# Altium schematic sheet 06-SIM800C.SchDoc: *MODUL SIM800
size A3; SheetNumber: 7; SheetTotal: 7
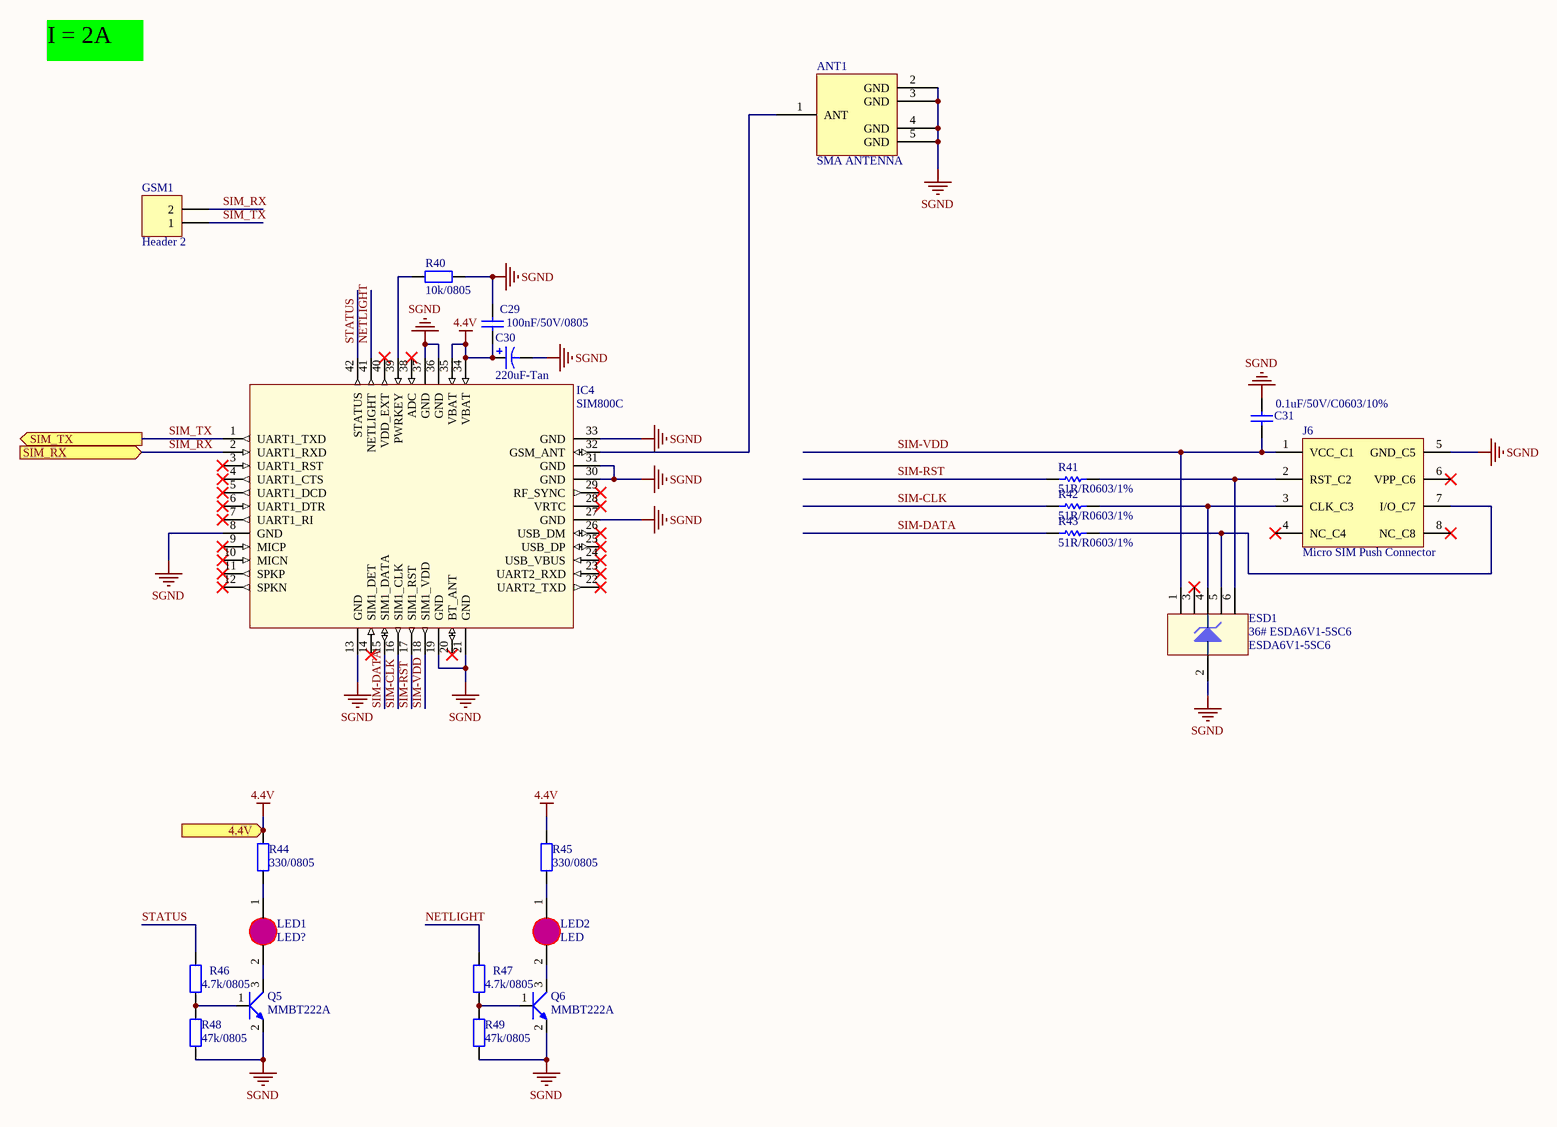
[diagram p0: 06-SIM800C.SchDoc]

## Parts
ANT1  SMA ANTENNA  [ANT-SMA-ST-F]
C29  100nF/50V/0805  [Cap Ceramic 0805 SMD]
C30  220uF-Tan  [CAP TANT CASE E SMD]
C31  0.1uF/50V/C0603/10%  [Cap Ceramic 0603 SMD]
ESD1  36# ESDA6V1-5SC6  Supplier Part Number 1: ESDA6V1-5SC6  [36# ESDA6V1-5SC6]
GSM1  Header 2  [Header_2]
IC4  SIM800C  [SIM800C]
J6  Micro SIM Push Connector  [9# SIM holder]
LED1  LED?  [Led 0805R]
LED2  LED  [Led 0805R]
Q5  MMBT222A  [MMBT2222A]
Q6  MMBT222A  [MMBT2222A]
R40  10k/0805  [RESC2012(0805)]
R41  51R/R0603/1%  [Res 0603 SMD]
R42  51R/R0603/1%  [Res 0603 SMD]
R43  51R/R0603/1%  [Res 0603 SMD]
R44  value 330/0805  [RESC2012(0805)]  (hidden comment: R0805)
R45  value 330/0805  [RESC2012(0805)]  (hidden comment: R0805)
R46  value 4.7k/0805  [RESC2012(0805)]  (hidden comment: R0805)
R47  value 4.7k/0805  [RESC2012(0805)]  (hidden comment: R0805)
R48  value 47k/0805  [RESC2012(0805)]  (hidden comment: R0805)
R49  value 47k/0805  [RESC2012(0805)]  (hidden comment: R0805)

## Ports
4.4V (in), SIM_RX (in), SIM_TX (out)

## Nets
4.4V: C29.1 C30.1 IC4.34(VBAT) IC4.35(VBAT) R44.1 R45.1 ; port 4.4V
SGND: ANT1.2(GND) ANT1.3(GND) ANT1.4(GND) ANT1.5(GND) C29.2 C30.2 C31.2 ESD1.2(GND) IC4.8(GND) IC4.13(GND) IC4.19(GND) IC4.21(GND) IC4.27(GND) IC4.30(GND) IC4.31(GND) IC4.33(GND) IC4.36(GND) IC4.37(GND) J6.5(GND_C5) Q5.2 Q6.2 R40.2 R48.2 R49.2
NETLIGHT: IC4.41(NETLIGHT) R47.1
SIM-CLK: IC4.16(SIM1_CLK) R42.1
SIM-DATA: IC4.15(SIM1_DATA) R43.1
SIM-RST: IC4.17(SIM1_RST) R41.1
SIM-VDD: C31.1 ESD1.1(IO1) IC4.18(SIM1_VDD) J6.1(VCC_C1)
SIM_RX: GSM1.2 IC4.2(UART1_RXD) ; port SIM_RX
SIM_TX: GSM1.1 IC4.1(UART1_TXD) ; port SIM_TX
STATUS: IC4.42(STATUS) R46.1
NetANT1_1: ANT1.1(ANT) IC4.32(GSM_ANT)
NetESD1_4: ESD1.4(IO3) J6.3(CLK_C3) R42.2
NetESD1_5: ESD1.5(IO4) J6.7(I/O_C7) R43.2
NetESD1_6: ESD1.6(IO5) J6.2(RST_C2) R41.2
NetIC4_39: IC4.39(PWRKEY) R40.1
NetLED1_1: LED1.1(A) R44.2
NetLED1_2: LED1.2(K) Q5.3
NetLED2_1: LED2.1(A) R45.2
NetLED2_2: LED2.2(K) Q6.3
NetQ5_1: Q5.1 R46.2 R48.1
NetQ6_1: Q6.1 R47.2 R49.1

Not connected (* = marked no-connect by the designer): ESD1 3(IO2)*; IC4 3(UART1_RST)* 4(UART1_CTS)* 5(UART1_DCD)* 6(UART1_DTR)* 7(UART1_RI)* 9(MICP)* 10(MICN)* 11(SPKP)* 12(SPKN)* 14(SIM1_DET)* 20(BT_ANT)* 22(UART2_TXD)* 23(UART2_RXD)* 24(USB_VBUS)* 25(USB_DP)* 26(USB_DM)* 28(VRTC)* 29(RF_SYNC)* 38(ADC)* 40(VDD_EXT)*; J6 4(NC_C4)* 6(VPP_C6)* 8(NC_C8)*

## Notes on the sheet
- I = 2A
- Title
- Size:
- Date:
- A3
- Number:
- Time:
- Revision:
- Sheet
- of
- File:

## Library data of the parts
C29 = CapSMD: Value: 33p; Published: 8-Jun-2000; LatestRevisionDate: 17-Jul-2002; LatestRevisionNote: Re-released for DXP Platform.; PackageReference: RAD-0.3; Publisher: Altium Limited
C30 = CAP1210-Tan
C31 = 0.1uF/50V/C0603/10%: CAP CER 0.1UF 50V 10% X7R 0603; Manufacturer: Murata Electronics North America; Manufacturer Part Number: GRM188R71H104KA93D; Capacitance: 0.1µF; RoHS: RoHS Compliant; Category: Capacitors; Packaging: Tape & Reel (TR); Tolerance: ±10%; Voltage - Rated: 50V; Temperature Coefficient: X7R; Mounting Type: Surface Mount, MLCC; Operating Temperature: -55°C ~ 125°C; Applications: General Purpose; Ratings: -; Package / Case: 0603 (1608 Metric); Size / Dimension: 0.063" L x 0.031" W (1.60mm x 0.80mm); Height - Seated (Max): -; Thickness (Max): 0.035" (0.90mm); Lead Spacing: -; Features: -; Lead Style: -; ComponentLink1URL: http://www.murata.com/~/media/webrenewal/support/library/catalog/products/capacitor/mlcc/c02e.ashx; ComponentLink1Description: http://www.murata.com/~/media/webrenewal/support/library/catalog/products/capacitor/mlcc/c02e.ashx; Supplier 1: Digi-Key; Supplier Part Number 1: 490-1519-1-ND
ESD1 = 36# ESDA6V1-5SC6: TRANSIL™ ARRAY FOR ESD PROTECTION; Supplier 1: Future Electronics
GSM1 = Header 2: Header, 2-Pin; LatestRevisionDate: 17-Jul-2002; LatestRevisionNote: Re-released for DXP Platform.; Publisher: Altium Limited
IC4 = SIM800C: SIM800C V1.00
J6 = 9#SIM Card Holder KF-016: https://www.alibaba.com/product-detail/Micro-SIM-Push-Connector-SIM-Card_60749325624.html?spm=a2700.7724838.2017115.23.25ee5ac4b0uZwo
LED1 LED2 = LED0805: LED SMD 0805
R40 R44-R49 = R0805: Resistor SMD 0805; Published: 8-Jun-2000; LatestRevisionDate: 17-Jul-2002; LatestRevisionNote: Re-released for DXP Platform.; PackageReference: AXIAL-0.4; Publisher: Altium Limited
R41-R43 = 22R/R0603/1%: RES SMD 22 OHM 1% 1/10W 0603; Manufacturer: Yageo; Manufacturer Part Number: RC0603FR-0722RL; Resistance (Ohms): 22; Power (Watts): 0.1W, 1/10W; Temperature Coefficient: ±100ppm/°C; RoHS: RoHS Compliant; Category: Resistors; Packaging: Cut Tape (CT); Tolerance: ±1%; Composition: Thick Film; Features: Moisture Resistant; Operating Temperature: -55°C ~ 155°C; Package / Case: 0603 (1608 Metric); Supplier Device Package: 0603; Size / Dimension: 0.063" L x 0.031" W (1.60mm x 0.80mm); Height: 0.022" (0.55mm); Number of Terminations: 2; ComponentLink1URL: http://www.yageo.com/NewPortal/yageodocoutput?fileName=/pdf/R-Chip/PYu-RC_Group_51_RoHS_L_3.pdf; ComponentLink1Description: http://www.yageo.com/NewPortal/yageodocoutput?fileName=/pdf/R-Chip/PYu-RC_Group_51_RoHS_L_3.pdf; Supplier 1: Digi-Key; Supplier Part Number 1: 311-22.0HRCT-ND